# Altium project maximator-shield.PrjPCB
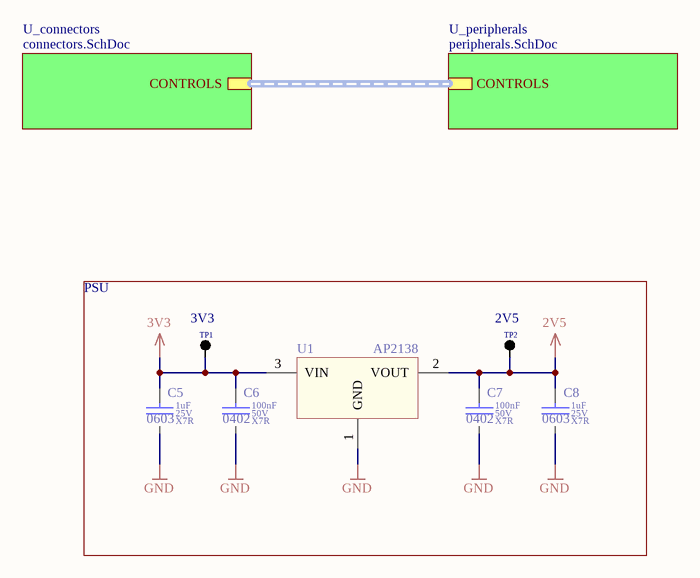
[diagram p0: top.SchDoc]
4 sheets, 56 parts. Net scope: hierarchical (ports join the sheet entries above them; power ports are global).
Board file: maximator-shield.PcbDoc
Sheets:
  top.SchDoc
    U_connectors = connectors.SchDoc
      U_pin_conditiong = pin_conditiong.SchDoc
    U_peripherals = peripherals.SchDoc

## Sheet top.SchDoc
size A4

### Parts
C5  value 1uF  Dielectric: X7R  Voltage: 25V  SCH_Footprint: 0603  [C_0603_1608]  (hidden comment: Ceramic X7R)
C6  value 100nF  Dielectric: X7R  Voltage: 50V  SCH_Footprint: 0402  [C_0402_1005]  (hidden comment: Ceramic X7R)
C7  value 100nF  Dielectric: X7R  Voltage: 50V  SCH_Footprint: 0402  [C_0402_1005]  (hidden comment: Ceramic X7R)
C8  value 1uF  Dielectric: X7R  Voltage: 25V  SCH_Footprint: 0603  [C_0603_1608]  (hidden comment: Ceramic X7R)
TP1  3V3  [TP_PAD]
TP2  2V5  [TP_PAD]
U1  AP2138  [AP2138]

### Blocks framed on the sheet
PSU: C5-C8 TP1 TP2 U1

### Sub-sheets
U_connectors = connectors.SchDoc: CONTROLS (harness CONTROLS)
U_peripherals = peripherals.SchDoc: CONTROLS (harness CONTROLS)

### Nets
2V5: C7.1 C8.1 TP2.1(TP) U1.2(VOUT)
3V3: C5.1 C6.1 TP1.1(TP) U1.3(VIN)
GND: C5.2 C6.2 C7.2 C8.2 U1.1(GND)

### Buses and harness runs
harness sheet U_connectors/CONTROLS = sheet U_peripherals/CONTROLS

### Library data of the parts
C5 C8 = C_1uF_25V_X7R_0603_10: Capacitor; Manufacturer: Samsung; Manufacturer Part Number: CL10B105KA8NNNC; Tolerance (%): 10; Part Number: C_1uF_25V_X7R_0603_10; HelpURL: http://www.tme.eu/pl/Document/4a42202b32dab16128fe107dd69598cc/samsung-chip-cap.pdf; Supplier 1: TME; Supplier Part Number 1: CL10B105KA8NNNC; Supplier 2: RS Components; Supplier 3: Farnell; Supplier 4: Mouser; Supplier 5: Digi-Key
C6 C7 = C_100nF_50V_X7R_0402_10: Capacitor; Manufacturer: Murata; Manufacturer Part Number: GRM155R71H104KE14D; Tolerance (%): 10; Part Number: C_100nF_50V_X7R_0402_10; HelpURL: http://docs-europe.electrocomponents.com/webdocs/145f/0900766b8145f9d2.pdf; Supplier 1: TME; Supplier Part Number 1: GRM155R71H104KE14D; Supplier 2: RS Components; Supplier Part Number 2: 8847087; Supplier 3: Farnell; Supplier Part Number 3: 2611912; Supplier 4: Mouser; Supplier Part Number 4: 81-GRM155R71H104KE4D; Supplier 5: Digi-Key; Supplier Part Number 5: 490-10700-1-ND
TP1 TP2 = TP_PAD: Testpoint; SCH_Footprint: SMD; Part Number: TP_PAD; Component Type: Standard (No BOM); Supplier 1: TME; Supplier 2: RS Components; Supplier 3: Farnell; Supplier 4: Mouser; Supplier 5: Digi-Key
U1 = AP2138: IC: stabilizator napięcia; LDO,liniowy,nieregulowany; 2,5V; SMD

## Sheet connectors.SchDoc
size A4
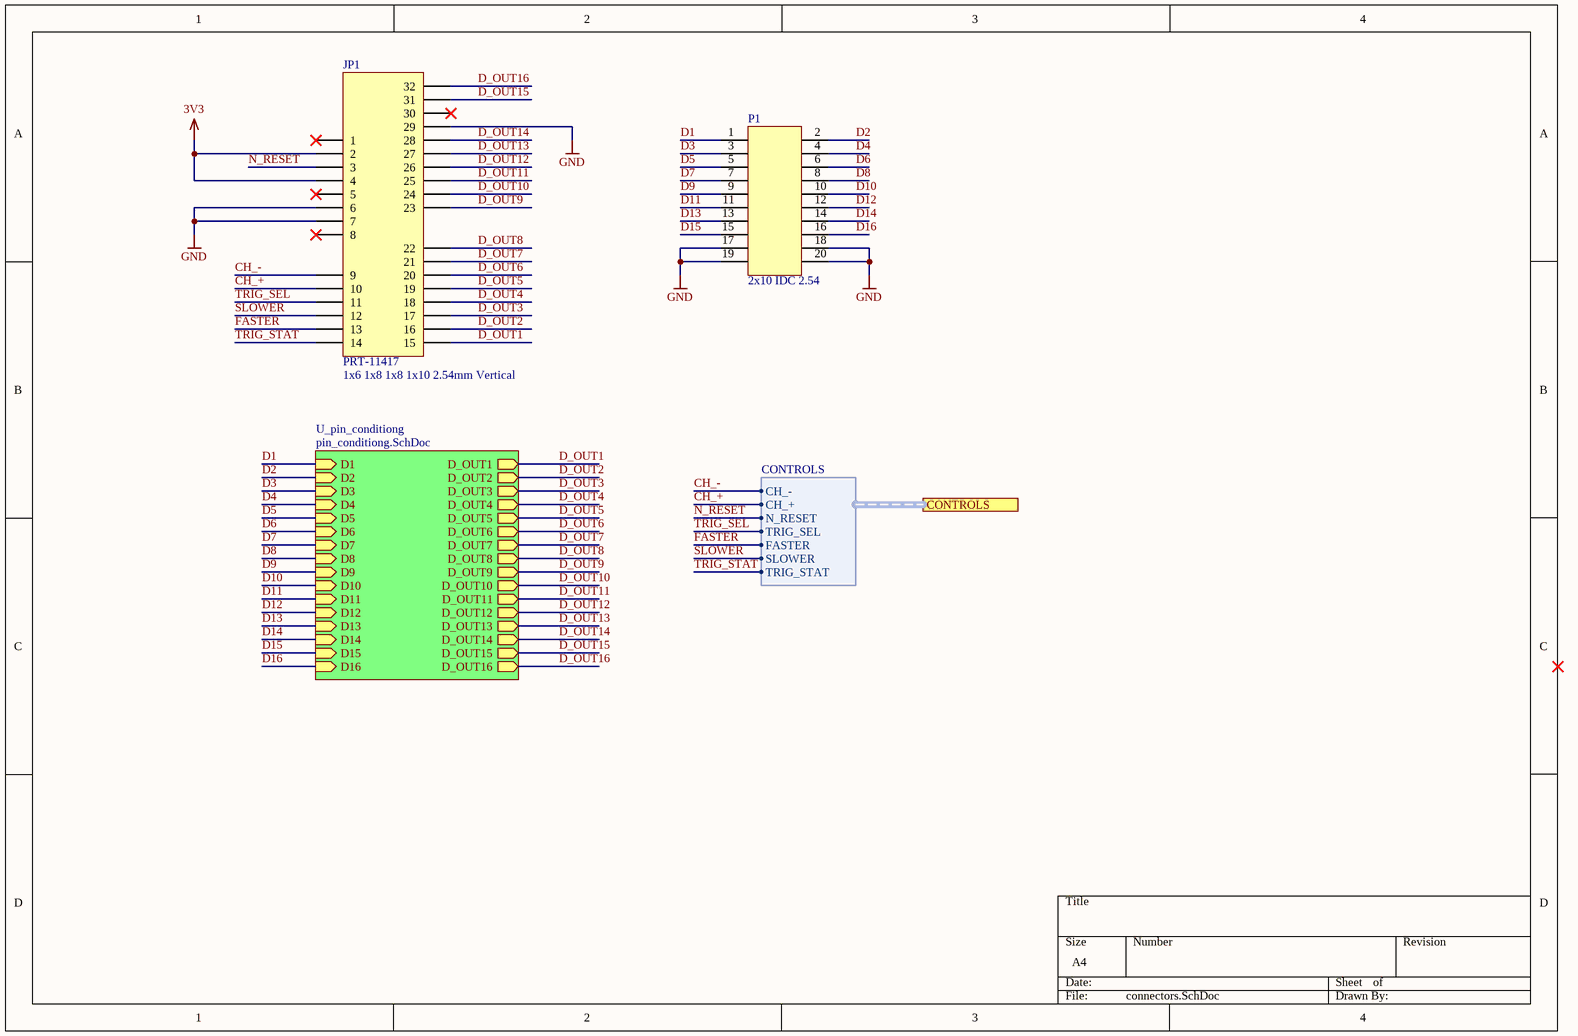
[diagram p1: connectors.SchDoc]

### Parts
JP1  value PRT-11417  SCH_Footprint: 1x6 1x8 1x8 1x10 2.54mm Vertical  [JP_ARDUINO_UNO_HEADER]  (hidden comment: Goldpin Male-Female straight)
P1  2x10 IDC 2.54  [J-LINK_20_pin_2.54]

### Sub-sheets
U_pin_conditiong = pin_conditiong.SchDoc: D1 (in), D2 (in), D3 (in), D4 (in), D5 (in), D6 (in), D7 (in), D8 (in), D9 (in), D10 (in), D11 (in), D12 (in), D13 (in), D14 (in), D15 (in), D16 (in), D_OUT1 (out), D_OUT2 (out), D_OUT3 (out), D_OUT4 (out), D_OUT5 (out), D_OUT6 (out), D_OUT7 (out), D_OUT8 (out), D_OUT9 (out), D_OUT10 (out), D_OUT11 (out), D_OUT12 (out), D_OUT13 (out), D_OUT14 (out), D_OUT15 (out), D_OUT16 (out)

### Ports
CONTROLS (harness CONTROLS)

### Harnesses
CONTROLS: CH_-, CH_+, N_RESET, TRIG_SEL, FASTER, SLOWER, TRIG_STAT

### Nets
3V3: JP1.2 JP1.4
GND: JP1.6 JP1.7 JP1.29 P1.17 P1.18 P1.19 P1.20
CH_+: JP1.10 ; port CONTROLS.CH_+
CH_-: JP1.9 ; port CONTROLS.CH_-
D1: P1.1 ; sheet U_pin_conditiong/D1
D2: P1.2 ; sheet U_pin_conditiong/D2
D3: P1.3 ; sheet U_pin_conditiong/D3
D4: P1.4 ; sheet U_pin_conditiong/D4
D5: P1.5 ; sheet U_pin_conditiong/D5
D6: P1.6 ; sheet U_pin_conditiong/D6
D7: P1.7 ; sheet U_pin_conditiong/D7
D8: P1.8 ; sheet U_pin_conditiong/D8
D9: P1.9 ; sheet U_pin_conditiong/D9
D10: P1.10 ; sheet U_pin_conditiong/D10
D11: P1.11 ; sheet U_pin_conditiong/D11
D12: P1.12 ; sheet U_pin_conditiong/D12
D13: P1.13 ; sheet U_pin_conditiong/D13
D14: P1.14 ; sheet U_pin_conditiong/D14
D15: P1.15 ; sheet U_pin_conditiong/D15
D16: P1.16 ; sheet U_pin_conditiong/D16
D_OUT1: JP1.15 ; sheet U_pin_conditiong/D_OUT1
D_OUT2: JP1.16 ; sheet U_pin_conditiong/D_OUT2
D_OUT3: JP1.17 ; sheet U_pin_conditiong/D_OUT3
D_OUT4: JP1.18 ; sheet U_pin_conditiong/D_OUT4
D_OUT5: JP1.19 ; sheet U_pin_conditiong/D_OUT5
D_OUT6: JP1.20 ; sheet U_pin_conditiong/D_OUT6
D_OUT7: JP1.21 ; sheet U_pin_conditiong/D_OUT7
D_OUT8: JP1.22 ; sheet U_pin_conditiong/D_OUT8
D_OUT9: JP1.23 ; sheet U_pin_conditiong/D_OUT9
D_OUT10: JP1.24 ; sheet U_pin_conditiong/D_OUT10
D_OUT11: JP1.25 ; sheet U_pin_conditiong/D_OUT11
D_OUT12: JP1.26 ; sheet U_pin_conditiong/D_OUT12
D_OUT13: JP1.27 ; sheet U_pin_conditiong/D_OUT13
D_OUT14: JP1.28 ; sheet U_pin_conditiong/D_OUT14
D_OUT15: JP1.31 ; sheet U_pin_conditiong/D_OUT15
D_OUT16: JP1.32 ; sheet U_pin_conditiong/D_OUT16
FASTER: JP1.13 ; port CONTROLS.FASTER
N_RESET: JP1.3 ; port CONTROLS.N_RESET
SLOWER: JP1.12 ; port CONTROLS.SLOWER
TRIG_SEL: JP1.11 ; port CONTROLS.TRIG_SEL
TRIG_STAT: JP1.14 ; port CONTROLS.TRIG_STAT

Not connected (* = marked no-connect by the designer): JP1 1* 5* 8* 30*

### Library data of the parts
JP1 = JP_ARDUINO_UNO_HEADER_1x6_1x8_1x8_1x10_2.54: Header 6-Pin, 8-Pin, 8-Pin, 10-Pin; Manufacturer: Sparkfun; Part Number: JP_ARDUINO_UNO_HEADER_1x6_1x8_1x8_1x10_2.54; Component Type: Standard; HelpURL: https://media.digikey.com/pdf/Data%20Sheets/Sparkfun%20PDFs/PRT-11417_Web.pdf; Manufacturer Part Number: PRT-11417; Supplier 1: TME; Supplier 2: RS Components; Supplier 3: Farnell; Supplier 4: Mouser; Supplier Part Number 4: 474-PRT-11417; Supplier 5: Digi-Key; Supplier Part Number 5: 1568-1413-ND
P1 = Header_2x10_2.54_Shrouded

## Sheet pin_conditiong.SchDoc
size A4
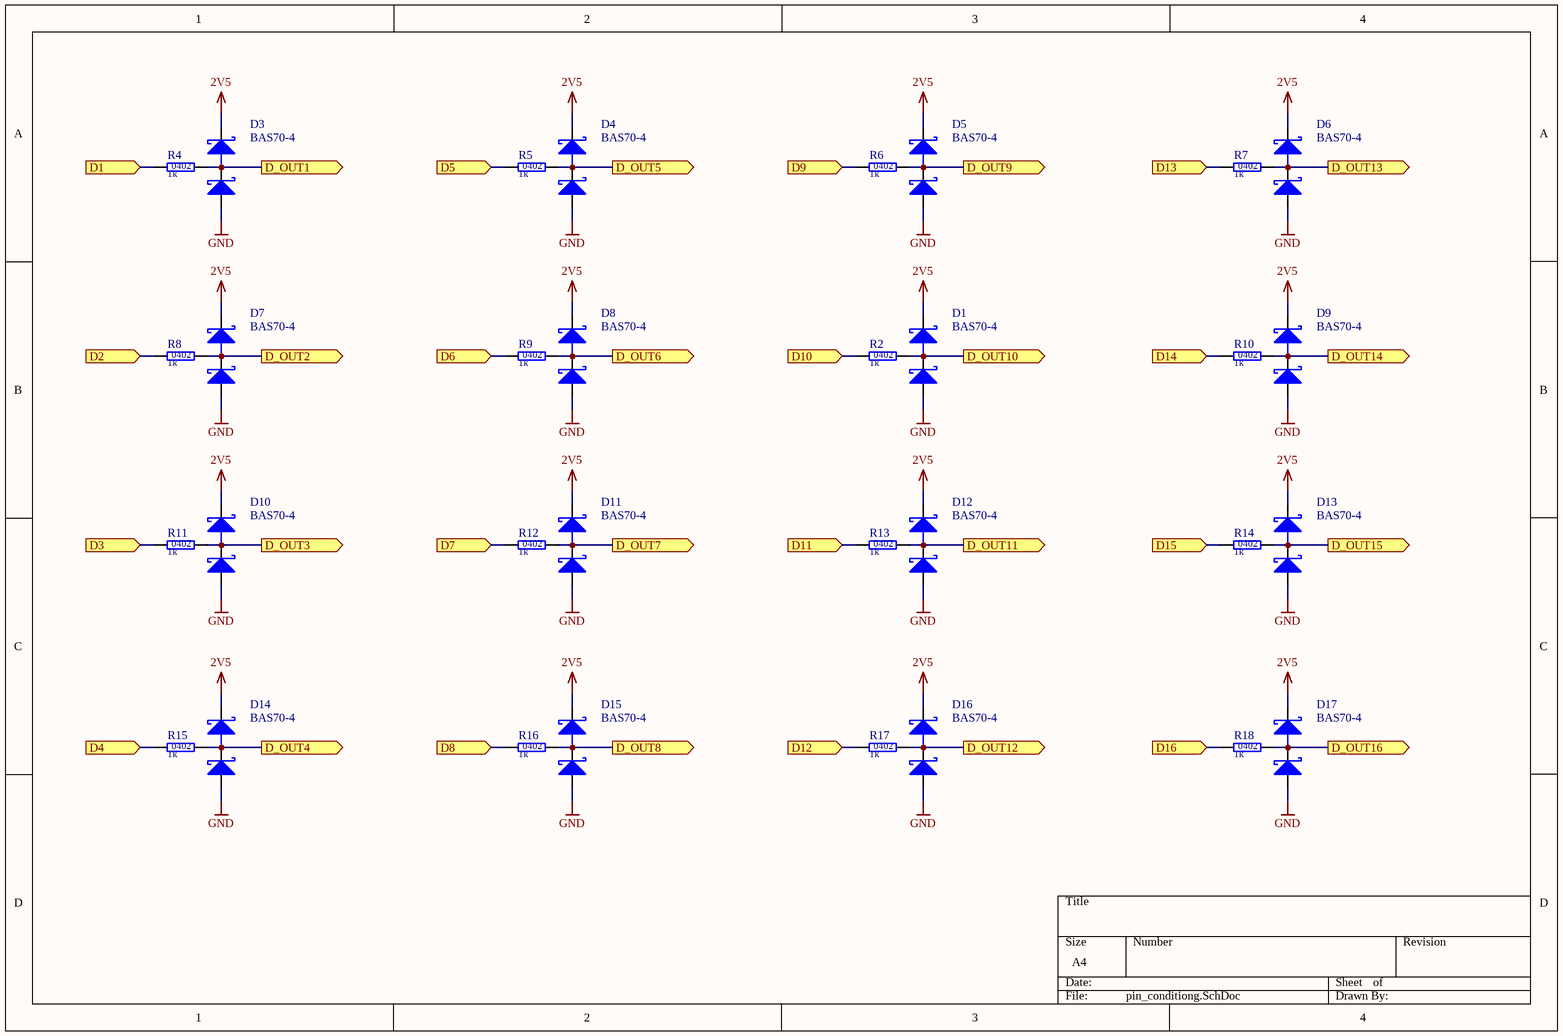
[diagram p2: pin_conditiong.SchDoc]

### Parts
D1  BAS70-4  [BAS70-4]
D3  BAS70-4  [BAS70-4]
D4  BAS70-4  [BAS70-4]
D5  BAS70-4  [BAS70-4]
D6  BAS70-4  [BAS70-4]
D7  BAS70-4  [BAS70-4]
D8  BAS70-4  [BAS70-4]
D9  BAS70-4  [BAS70-4]
D10  BAS70-4  [BAS70-4]
D11  BAS70-4  [BAS70-4]
D12  BAS70-4  [BAS70-4]
D13  BAS70-4  [BAS70-4]
D14  BAS70-4  [BAS70-4]
D15  BAS70-4  [BAS70-4]
D16  BAS70-4  [BAS70-4]
D17  BAS70-4  [BAS70-4]
R2  value 1k  SCH_Footprint: 0402  [R_0402_1005]  (hidden comment: Resistor)
R4  value 1k  SCH_Footprint: 0402  [R_0402_1005]  (hidden comment: Resistor)
R5  value 1k  SCH_Footprint: 0402  [R_0402_1005]  (hidden comment: Resistor)
R6  value 1k  SCH_Footprint: 0402  [R_0402_1005]  (hidden comment: Resistor)
R7  value 1k  SCH_Footprint: 0402  [R_0402_1005]  (hidden comment: Resistor)
R8  value 1k  SCH_Footprint: 0402  [R_0402_1005]  (hidden comment: Resistor)
R9  value 1k  SCH_Footprint: 0402  [R_0402_1005]  (hidden comment: Resistor)
R10  value 1k  SCH_Footprint: 0402  [R_0402_1005]  (hidden comment: Resistor)
R11  value 1k  SCH_Footprint: 0402  [R_0402_1005]  (hidden comment: Resistor)
R12  value 1k  SCH_Footprint: 0402  [R_0402_1005]  (hidden comment: Resistor)
R13  value 1k  SCH_Footprint: 0402  [R_0402_1005]  (hidden comment: Resistor)
R14  value 1k  SCH_Footprint: 0402  [R_0402_1005]  (hidden comment: Resistor)
R15  value 1k  SCH_Footprint: 0402  [R_0402_1005]  (hidden comment: Resistor)
R16  value 1k  SCH_Footprint: 0402  [R_0402_1005]  (hidden comment: Resistor)
R17  value 1k  SCH_Footprint: 0402  [R_0402_1005]  (hidden comment: Resistor)
R18  value 1k  SCH_Footprint: 0402  [R_0402_1005]  (hidden comment: Resistor)

### Ports
D1 (in), D2 (in), D3 (in), D4 (in), D5 (in), D6 (in), D7 (in), D8 (in), D9 (in), D10 (in), D11 (in), D12 (in), D13 (in), D14 (in), D15 (in), D16 (in), D_OUT1 (out), D_OUT2 (out), D_OUT3 (out), D_OUT4 (out), D_OUT5 (out), D_OUT6 (out), D_OUT7 (out), D_OUT8 (out), D_OUT9 (out), D_OUT10 (out), D_OUT11 (out), D_OUT12 (out), D_OUT13 (out), D_OUT14 (out), D_OUT15 (out), D_OUT16 (out)

### Nets
2V5: D1.2(VCC) D3.2(VCC) D4.2(VCC) D5.2(VCC) D6.2(VCC) D7.2(VCC) D8.2(VCC) D9.2(VCC) D10.2(VCC) D11.2(VCC) D12.2(VCC) D13.2(VCC) D14.2(VCC) D15.2(VCC) D16.2(VCC) D17.2(VCC)
GND: D1.1(GND) D3.1(GND) D4.1(GND) D5.1(GND) D6.1(GND) D7.1(GND) D8.1(GND) D9.1(GND) D10.1(GND) D11.1(GND) D12.1(GND) D13.1(GND) D14.1(GND) D15.1(GND) D16.1(GND) D17.1(GND)
D1: R4.1 ; port D1
D2: R8.1 ; port D2
D3: R11.1 ; port D3
D4: R15.1 ; port D4
D5: R5.1 ; port D5
D6: R9.1 ; port D6
D7: R12.1 ; port D7
D8: R16.1 ; port D8
D9: R6.1 ; port D9
D10: R2.1 ; port D10
D11: R13.1 ; port D11
D12: R17.1 ; port D12
D13: R7.1 ; port D13
D14: R10.1 ; port D14
D15: R14.1 ; port D15
D16: R18.1 ; port D16
D_OUT1: D3.3(SIG) R4.2 ; port D_OUT1
D_OUT2: D7.3(SIG) R8.2 ; port D_OUT2
D_OUT3: D10.3(SIG) R11.2 ; port D_OUT3
D_OUT4: D14.3(SIG) R15.2 ; port D_OUT4
D_OUT5: D4.3(SIG) R5.2 ; port D_OUT5
D_OUT6: D8.3(SIG) R9.2 ; port D_OUT6
D_OUT7: D11.3(SIG) R12.2 ; port D_OUT7
D_OUT8: D15.3(SIG) R16.2 ; port D_OUT8
D_OUT9: D5.3(SIG) R6.2 ; port D_OUT9
D_OUT10: D1.3(SIG) R2.2 ; port D_OUT10
D_OUT11: D12.3(SIG) R13.2 ; port D_OUT11
D_OUT12: D16.3(SIG) R17.2 ; port D_OUT12
D_OUT13: D6.3(SIG) R7.2 ; port D_OUT13
D_OUT14: D9.3(SIG) R10.2 ; port D_OUT14
D_OUT15: D13.3(SIG) R14.2 ; port D_OUT15
D_OUT16: D17.3(SIG) R18.2 ; port D_OUT16

### Library data of the parts
D1 D3-D17 = BAS70-4: Dioda: prostownicza Schottky; SMD; 70V; 70mA; 5ns; SOT23; 200mW
R2 R4-R18 = R_1k_0402_1: Manufacturer: Yageo; Manufacturer Part Number: RC0402FR-071K; Voltage: 50V; Power: 63mW; Tolerance: 1%; Part Number: R_1k_0402_1; HelpURL: http://www.tme.eu/pl/Document/1a2bc76e2be68b3b1670068306778ce6/rc0402yageo.pdf; Supplier 1: TME; Supplier Part Number 1: RC0402FR-071K; Supplier 2: RS Components; Supplier 3: Farnell; Supplier Part Number 3: 9239235; Supplier 4: Mouser; Supplier Part Number 4: 603-RC0402FR-071KP; Supplier 5: Digi-Key; Supplier Part Number 5: 311-1.00KLRCT-ND

## Sheet peripherals.SchDoc
size A4
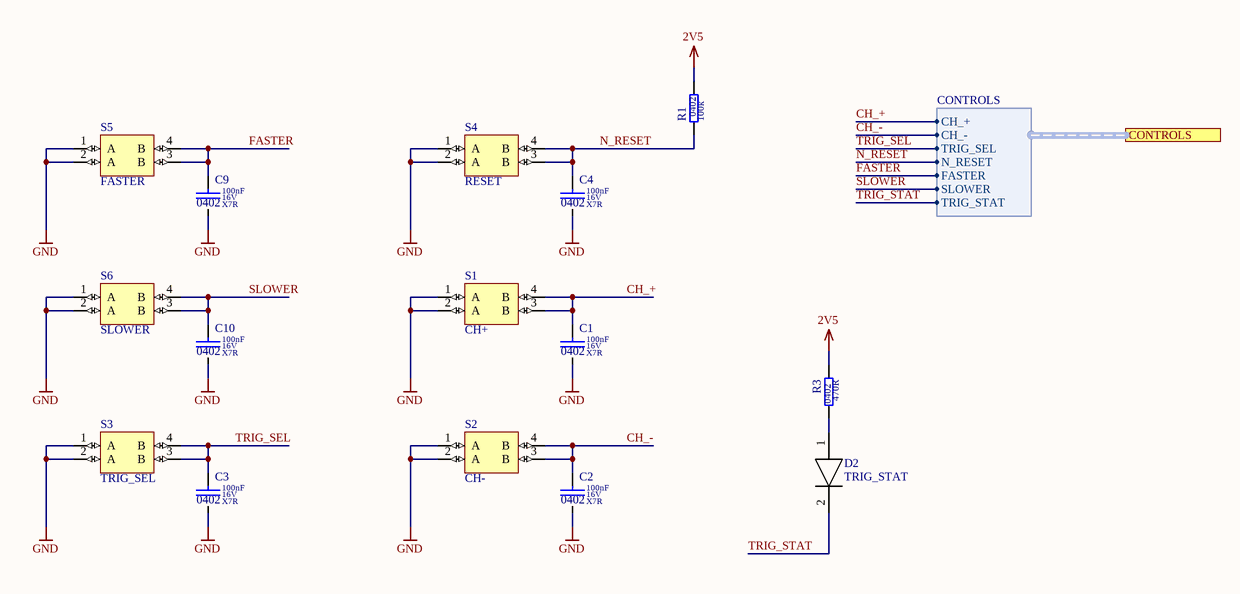
[diagram p3: peripherals.SchDoc]

### Parts
C1  value 100nF  Dielectric: X7R  Voltage: 16V  SCH_Footprint: 0402  [C_0402_1005]  (hidden comment: Ceramic X7R)
C2  value 100nF  Dielectric: X7R  Voltage: 16V  SCH_Footprint: 0402  [C_0402_1005]  (hidden comment: Ceramic X7R)
C3  value 100nF  Dielectric: X7R  Voltage: 16V  SCH_Footprint: 0402  [C_0402_1005]  (hidden comment: Ceramic X7R)
C4  value 100nF  Dielectric: X7R  Voltage: 16V  SCH_Footprint: 0402  [C_0402_1005]  (hidden comment: Ceramic X7R)
C9  value 100nF  Dielectric: X7R  Voltage: 16V  SCH_Footprint: 0402  [C_0402_1005]  (hidden comment: Ceramic X7R)
C10  value 100nF  Dielectric: X7R  Voltage: 16V  SCH_Footprint: 0402  [C_0402_1005]  (hidden comment: Ceramic X7R)
D2  TRIG_STAT  [LED_5mm]
R1  value 100k  SCH_Footprint: 0402  [R_0402_1005]  (hidden comment: Resistor)
R3  value 470R  SCH_Footprint: 0402  [R_0402_1005]  (hidden comment: Resistor)
S1  CH+  [TACT-613N-F]
S2  CH-  [TACT-613N-F]
S3  TRIG_SEL  [TACT-613N-F]
S4  RESET  [TACT-613N-F]
S5  FASTER  [TACT-613N-F]
S6  SLOWER  [TACT-613N-F]

### Ports
CONTROLS (harness CONTROLS)

### Harnesses
CONTROLS: CH_+, CH_-, TRIG_SEL, N_RESET, FASTER, SLOWER, TRIG_STAT

### Nets
2V5: R1.2 R3.1
GND: C1.2 C2.2 C3.2 C4.2 C9.2 C10.2 S1.1(A) S1.2(A) S2.1(A) S2.2(A) S3.1(A) S3.2(A) S4.1(A) S4.2(A) S5.1(A) S5.2(A) S6.1(A) S6.2(A)
CH_+: C1.1 S1.3(B) S1.4(B) ; port CONTROLS.CH_+
CH_-: C2.1 S2.3(B) S2.4(B) ; port CONTROLS.CH_-
FASTER: C9.1 S5.3(B) S5.4(B) ; port CONTROLS.FASTER
N_RESET: C4.1 R1.1 S4.3(B) S4.4(B) ; port CONTROLS.N_RESET
SLOWER: C10.1 S6.3(B) S6.4(B) ; port CONTROLS.SLOWER
TRIG_SEL: C3.1 S3.3(B) S3.4(B) ; port CONTROLS.TRIG_SEL
TRIG_STAT: D2.2(Cathode) ; port CONTROLS.TRIG_STAT
NetD2_1: D2.1(Anode) R3.2

### Library data of the parts
C1-C4 C9 C10 = C_100nF_16V_X7R_0402_10: Capacitor; Manufacturer: Murata; Manufacturer Part Number: GRM155R71C104KA88D; Tolerance (%): 10; Part Number: C_100nF_16V_X7R_0402_10; HelpURL: https://www.mouser.com/ds/2/281/c02e-2905.pdf; Supplier 1: TME; Supplier 2: RS Components; Supplier 3: Farnell; Supplier 4: Mouser; Supplier Part Number 4: 81-GRM155R71C104KA88; Supplier 5: Digi-Key
D2 = LED_5mm: LED_5mm Diameter
R1 = R_100k_0402_1: Manufacturer: Yageo; Manufacturer Part Number: RC0402FR-07100KL; Voltage: 50V; Power: 63mW; Tolerance: 1%; Part Number: R_100k_0402_1; HelpURL: http://www.tme.eu/pl/Document/1a2bc76e2be68b3b1670068306778ce6/rc0402yageo.pdf; Supplier 1: TME; Supplier Part Number 1: RC0402FR-07100K; Supplier 2: RS Components; Supplier 3: Farnell; Supplier Part Number 3: 2131798; Supplier 4: Mouser; Supplier Part Number 4: 603-RC0402FR-07100KL; Supplier 5: Digi-Key; Supplier Part Number 5: 311-100KLRCT-ND
R3 = R_470R_0402_1: Manufacturer: Yageo; Manufacturer Part Number: RC0402FR-07470RL; Voltage: 50V; Power: 63mW; Tolerance: 1%; Part Number: R_470R_0402_1; HelpURL: http://datasheet.octopart.com/RC0402FR-07470RL-Yageo-datasheet-10408619.pdf; Supplier 1: TME; Supplier Part Number 1: RC0402FR-07470R; Supplier 2: RS Components; Supplier 3: Farnell; Supplier Part Number 3: 9239197; Supplier 4: Mouser; Supplier Part Number 4: 603-RC0402FR-07470RL; Supplier 5: Digi-Key; Supplier Part Number 5: 311-470LRCT-ND
S1-S6 = TACT-613N-F

## Nets that join several sheets
2V5: top (C7.1 C8.1 TP2.1 U1.2), pin_conditiong (16 pins), peripherals (R1.2 R3.1)
3V3: top (C5.1 C6.1 TP1.1 U1.3), connectors (JP1.2 JP1.4)
GND: top (5 pins), connectors (7 pins), pin_conditiong (16 pins), peripherals (18 pins)
CH_+: connectors (JP1.10), peripherals (C1.1 S1.3 S1.4)
CH_-: connectors (JP1.9), peripherals (C2.1 S2.3 S2.4)
D1: connectors (P1.1), pin_conditiong (R4.1)
D2: connectors (P1.2), pin_conditiong (R8.1)
D3: connectors (P1.3), pin_conditiong (R11.1)
D4: connectors (P1.4), pin_conditiong (R15.1)
D5: connectors (P1.5), pin_conditiong (R5.1)
D6: connectors (P1.6), pin_conditiong (R9.1)
D7: connectors (P1.7), pin_conditiong (R12.1)
D8: connectors (P1.8), pin_conditiong (R16.1)
D9: connectors (P1.9), pin_conditiong (R6.1)
D10: connectors (P1.10), pin_conditiong (R2.1)
D11: connectors (P1.11), pin_conditiong (R13.1)
D12: connectors (P1.12), pin_conditiong (R17.1)
D13: connectors (P1.13), pin_conditiong (R7.1)
D14: connectors (P1.14), pin_conditiong (R10.1)
D15: connectors (P1.15), pin_conditiong (R14.1)
D16: connectors (P1.16), pin_conditiong (R18.1)
D_OUT1: connectors (JP1.15), pin_conditiong (D3.3 R4.2)
D_OUT2: connectors (JP1.16), pin_conditiong (D7.3 R8.2)
D_OUT3: connectors (JP1.17), pin_conditiong (D10.3 R11.2)
D_OUT4: connectors (JP1.18), pin_conditiong (D14.3 R15.2)
D_OUT5: connectors (JP1.19), pin_conditiong (D4.3 R5.2)
D_OUT6: connectors (JP1.20), pin_conditiong (D8.3 R9.2)
D_OUT7: connectors (JP1.21), pin_conditiong (D11.3 R12.2)
D_OUT8: connectors (JP1.22), pin_conditiong (D15.3 R16.2)
D_OUT9: connectors (JP1.23), pin_conditiong (D5.3 R6.2)
D_OUT10: connectors (JP1.24), pin_conditiong (D1.3 R2.2)
D_OUT11: connectors (JP1.25), pin_conditiong (D12.3 R13.2)
D_OUT12: connectors (JP1.26), pin_conditiong (D16.3 R17.2)
D_OUT13: connectors (JP1.27), pin_conditiong (D6.3 R7.2)
D_OUT14: connectors (JP1.28), pin_conditiong (D9.3 R10.2)
D_OUT15: connectors (JP1.31), pin_conditiong (D13.3 R14.2)
D_OUT16: connectors (JP1.32), pin_conditiong (D17.3 R18.2)
FASTER: connectors (JP1.13), peripherals (C9.1 S5.3 S5.4)
N_RESET: connectors (JP1.3), peripherals (C4.1 R1.1 S4.3 S4.4)
SLOWER: connectors (JP1.12), peripherals (C10.1 S6.3 S6.4)
TRIG_SEL: connectors (JP1.11), peripherals (C3.1 S3.3 S3.4)
TRIG_STAT: connectors (JP1.14), peripherals (D2.2)